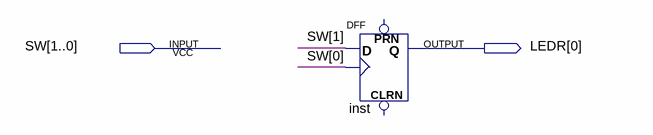
[diagram p0: schematic sheet]
// Quartus schematic dfftest.bdf as structural Verilog: 1 symbols, 2 pins
module dfftest (
  input  [1:0] SW,
  output [0:0] LEDR
);

  DFF inst (.CLK(SW[0]), .D(SW[1]), .Q(LEDR[0]));  // open: CLRN, PRN
endmodule
